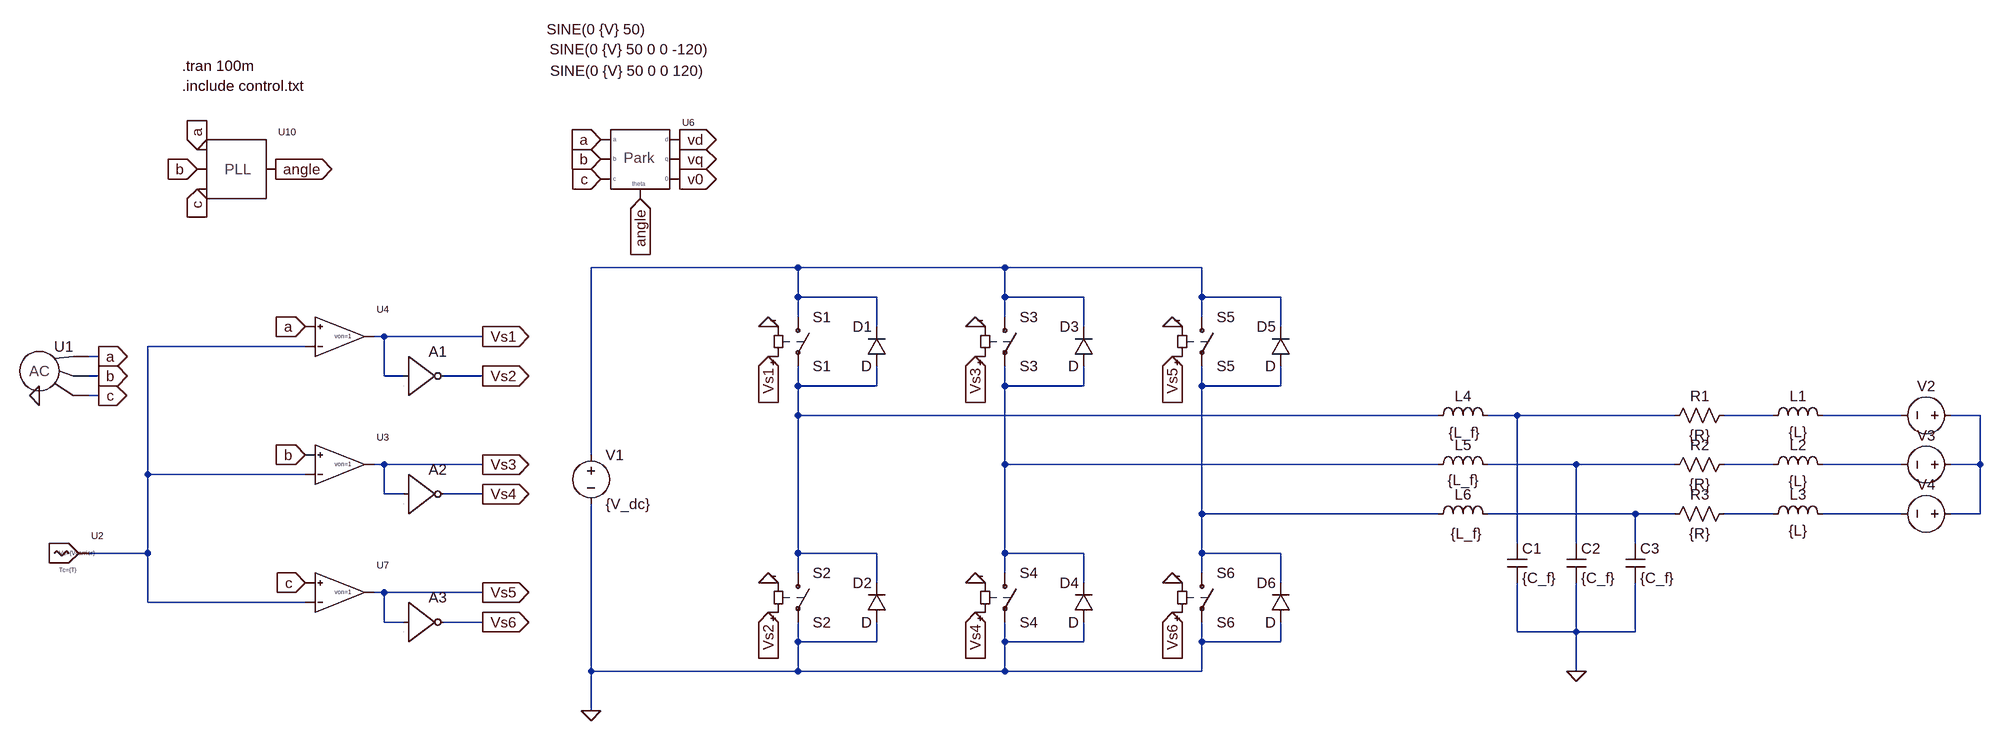
[diagram p0: schematic control.asc]
control.asc, the LTspice schematic file:
Version 4
SHEET 1 1320 772
WIRE -608 32 -944 32
WIRE -272 32 -608 32
WIRE 48 32 -272 32
WIRE -608 80 -608 32
WIRE -480 80 -608 80
WIRE -272 80 -272 32
WIRE -144 80 -272 80
WIRE 48 80 48 32
WIRE 176 80 48 80
WIRE -608 112 -608 80
WIRE -272 112 -272 80
WIRE 48 112 48 80
WIRE -480 128 -480 80
WIRE -144 128 -144 80
WIRE 176 128 176 80
WIRE -1280 144 -1296 144
WIRE -1120 144 -1280 144
WIRE -1408 160 -1664 160
WIRE -1744 176 -1760 176
WIRE -1744 208 -1760 208
WIRE -1280 208 -1280 144
WIRE -1248 208 -1280 208
WIRE -1120 208 -1184 208
WIRE -608 224 -608 192
WIRE -480 224 -480 192
WIRE -480 224 -608 224
WIRE -272 224 -272 192
WIRE -144 224 -144 192
WIRE -144 224 -272 224
WIRE 48 224 48 192
WIRE 176 224 176 192
WIRE 176 224 48 224
WIRE -1744 240 -1760 240
WIRE -608 272 -608 224
WIRE 432 272 -608 272
WIRE 560 272 512 272
WIRE 816 272 560 272
WIRE 976 272 896 272
WIRE 1184 272 1056 272
WIRE 1312 272 1264 272
WIRE -944 336 -944 32
WIRE -1280 352 -1296 352
WIRE -1120 352 -1280 352
WIRE -272 352 -272 224
WIRE 432 352 -272 352
WIRE 656 352 512 352
WIRE 816 352 656 352
WIRE 976 352 896 352
WIRE 1184 352 1056 352
WIRE 1312 352 1312 272
WIRE 1312 352 1264 352
WIRE -1664 368 -1664 160
WIRE -1408 368 -1664 368
WIRE -1280 400 -1280 352
WIRE -1248 400 -1280 400
WIRE -1120 400 -1184 400
WIRE 48 432 48 224
WIRE 432 432 48 432
WIRE 752 432 512 432
WIRE 816 432 752 432
WIRE 976 432 896 432
WIRE 1184 432 1056 432
WIRE 1312 432 1312 352
WIRE 1312 432 1264 432
WIRE 560 480 560 272
WIRE 656 480 656 352
WIRE 752 480 752 432
WIRE -1664 496 -1664 368
WIRE -1664 496 -1760 496
WIRE -608 496 -608 272
WIRE -480 496 -608 496
WIRE -272 496 -272 352
WIRE -144 496 -272 496
WIRE 48 496 48 432
WIRE 176 496 48 496
WIRE -608 528 -608 496
WIRE -272 528 -272 496
WIRE 48 528 48 496
WIRE -480 544 -480 496
WIRE -144 544 -144 496
WIRE 176 544 176 496
WIRE -1280 560 -1296 560
WIRE -1120 560 -1280 560
WIRE -1664 576 -1664 496
WIRE -1408 576 -1664 576
WIRE -1280 608 -1280 560
WIRE -1248 608 -1280 608
WIRE -1120 608 -1184 608
WIRE 560 624 560 544
WIRE 656 624 656 544
WIRE 656 624 560 624
WIRE 752 624 752 544
WIRE 752 624 656 624
WIRE -608 640 -608 608
WIRE -480 640 -480 608
WIRE -480 640 -608 640
WIRE -272 640 -272 608
WIRE -144 640 -144 608
WIRE -144 640 -272 640
WIRE 48 640 48 608
WIRE 176 640 176 608
WIRE 176 640 48 640
WIRE -944 688 -944 416
WIRE -608 688 -608 640
WIRE -608 688 -944 688
WIRE -272 688 -272 640
WIRE -272 688 -608 688
WIRE 48 688 48 640
WIRE 48 688 -272 688
WIRE 656 688 656 624
WIRE -944 752 -944 688
FLAG -656 128 0
FLAG -656 544 0
FLAG -320 128 0
FLAG 0 128 0
FLAG 0 544 0
FLAG -320 544 0
FLAG -1744 176 a
IOPIN -1744 176 Out
FLAG -1744 208 b
IOPIN -1744 208 Out
FLAG -1744 240 c
IOPIN -1744 240 Out
FLAG -1408 128 a
IOPIN -1408 128 In
FLAG -1408 336 b
IOPIN -1408 336 In
FLAG -1408 544 c
IOPIN -1408 544 In
FLAG -1120 144 Vs1
IOPIN -1120 144 Out
FLAG -1120 352 Vs3
IOPIN -1120 352 Out
FLAG -1120 560 Vs5
IOPIN -1120 560 Out
FLAG -1120 208 Vs2
IOPIN -1120 208 Out
FLAG -1120 400 Vs4
IOPIN -1120 400 Out
FLAG -1120 608 Vs6
IOPIN -1120 608 Out
FLAG -656 176 Vs1
IOPIN -656 176 In
FLAG -320 176 Vs3
IOPIN -320 176 In
FLAG -320 592 Vs4
IOPIN -320 592 In
FLAG 0 176 Vs5
IOPIN 0 176 In
FLAG 0 592 Vs6
IOPIN 0 592 In
FLAG -656 592 Vs2
IOPIN -656 592 In
FLAG -944 752 0
FLAG -1456 -128 angle
IOPIN -1456 -128 Out
FLAG -928 -176 a
IOPIN -928 -176 In
FLAG -928 -144 b
IOPIN -928 -144 In
FLAG -928 -112 c
IOPIN -928 -112 In
FLAG -1584 -160 a
IOPIN -1584 -160 In
FLAG -1584 -128 b
IOPIN -1584 -128 In
FLAG -1584 -96 c
IOPIN -1584 -96 In
FLAG -864 -80 angle
IOPIN -864 -80 In
FLAG -800 -176 vd
IOPIN -800 -176 Out
FLAG -800 -144 vq
IOPIN -800 -144 Out
FLAG -800 -112 v0
IOPIN -800 -112 Out
FLAG 656 688 0
FLAG -1840 240 0
SYMBOL voltage -944 320 R0
WINDOW 123 0 0 Left 0
WINDOW 39 0 0 Left 0
SYMATTR InstName V1
SYMATTR Value {V_dc}
SYMBOL sw -608 96 R0
SYMATTR InstName S1
SYMATTR Value S1
SYMBOL sw -608 512 R0
SYMATTR InstName S2
SYMATTR Value S2
SYMBOL sw -272 96 R0
SYMATTR InstName S3
SYMATTR Value S3
SYMBOL sw -272 512 R0
SYMATTR InstName S4
SYMATTR Value S4
SYMBOL sw 48 96 R0
SYMATTR InstName S5
SYMATTR Value S5
SYMBOL sw 48 512 R0
SYMATTR InstName S6
SYMATTR Value S6
SYMBOL diode -464 192 R180
WINDOW 0 24 64 Left 2
WINDOW 3 24 0 Left 2
SYMATTR InstName D1
SYMBOL diode -464 608 R180
WINDOW 0 24 64 Left 2
WINDOW 3 24 0 Left 2
SYMATTR InstName D2
SYMBOL diode -128 192 R180
WINDOW 0 24 64 Left 2
WINDOW 3 24 0 Left 2
SYMATTR InstName D3
SYMBOL diode -128 608 R180
WINDOW 0 24 64 Left 2
WINDOW 3 24 0 Left 2
SYMATTR InstName D4
SYMBOL diode 192 192 R180
WINDOW 0 24 64 Left 2
WINDOW 3 24 0 Left 2
SYMATTR InstName D5
SYMBOL diode 192 608 R180
WINDOW 0 24 64 Left 2
WINDOW 3 24 0 Left 2
SYMATTR InstName D6
SYMBOL res 912 256 R90
WINDOW 0 0 56 VBottom 2
WINDOW 3 32 56 VTop 2
SYMATTR InstName R1
SYMATTR Value {R}
SYMBOL res 912 336 R90
WINDOW 0 0 56 VBottom 2
WINDOW 3 32 56 VTop 2
SYMATTR InstName R2
SYMATTR Value {R}
SYMBOL res 912 416 R90
WINDOW 0 0 56 VBottom 2
WINDOW 3 32 56 VTop 2
SYMATTR InstName R3
SYMATTR Value {R}
SYMBOL voltage 1280 272 R90
WINDOW 0 -32 56 VBottom 2
WINDOW 3 -643 2217 VTop 2
WINDOW 123 0 0 Left 0
WINDOW 39 0 0 Left 0
SYMATTR InstName V2
SYMATTR Value SINE(0 {V} 50)
SYMBOL voltage 1280 352 R90
WINDOW 0 -32 56 VBottom 2
WINDOW 3 -691 2164 VTop 2
WINDOW 123 0 0 Left 0
WINDOW 39 0 0 Left 0
SYMATTR InstName V3
SYMATTR Value SINE(0 {V} 50 0 0 -120)
SYMBOL voltage 1280 432 R90
WINDOW 0 -32 56 VBottom 2
WINDOW 3 -736 2167 VTop 2
WINDOW 123 0 0 Left 0
WINDOW 39 0 0 Left 0
SYMATTR InstName V4
SYMATTR Value SINE(0 {V} 50 0 0 120)
SYMBOL ind 960 288 R270
WINDOW 0 32 56 VTop 2
WINDOW 3 5 56 VBottom 2
SYMATTR InstName L1
SYMATTR Value {L}
SYMBOL ind 960 368 R270
WINDOW 0 32 56 VTop 2
WINDOW 3 5 56 VBottom 2
SYMATTR InstName L2
SYMATTR Value {L}
SYMBOL ind 960 448 R270
WINDOW 0 32 56 VTop 2
WINDOW 3 5 56 VBottom 2
SYMATTR InstName L3
SYMATTR Value {L}
SYMBOL ind 416 288 R270
WINDOW 0 32 56 VTop 2
WINDOW 3 4 58 VBottom 2
SYMATTR InstName L4
SYMATTR Value {L_f}
SYMBOL ind 416 368 R270
WINDOW 0 32 56 VTop 2
WINDOW 3 7 56 VBottom 2
SYMATTR InstName L5
SYMATTR Value {L_f}
SYMBOL ind 416 448 R270
WINDOW 0 32 56 VTop 2
WINDOW 3 0 61 VBottom 2
SYMATTR InstName L6
SYMATTR Value {L_f}
SYMBOL cap 544 480 R0
SYMATTR InstName C1
SYMATTR Value {C_f}
SYMBOL cap 640 480 R0
SYMATTR InstName C2
SYMATTR Value {C_f}
SYMBOL cap 736 480 R0
SYMATTR InstName C3
SYMATTR Value {C_f}
SYMBOL Yn3Phase -1840 144 R0
SYMATTR InstName U1
SYMBOL park -864 -144 R0
SYMATTR InstName U6
SYMBOL trianglesignal -1808 496 R0
WINDOW 3 0 0 Left 0
WINDOW 123 0 28 Left 0
SYMATTR Value Vc={Vcarrier}
SYMATTR Value2 Tc={T}
SYMATTR InstName U2
SYMBOL comparator -1360 560 R0
WINDOW 3 0 0 Left 0
SYMATTR InstName U7
SYMATTR Value von=1
SYMBOL comparator -1360 352 R0
WINDOW 3 0 0 Left 0
SYMATTR InstName U3
SYMATTR Value von=1
SYMBOL comparator -1360 144 R0
WINDOW 3 0 0 Left 0
SYMATTR InstName U4
SYMATTR Value von=1
SYMBOL PLL -1520 -128 R0
SYMATTR InstName U10
SYMBOL Digital\\inv -1248 144 R0
SYMATTR InstName A1
SYMBOL Digital\\inv -1248 336 R0
SYMATTR InstName A2
SYMBOL Digital\\inv -1248 544 R0
SYMATTR InstName A3
TEXT -1608 -296 Left 2 !.tran 100m
TEXT -1608 -264 Left 2 !.include control.txt

The netlist it stands for:
* control.asc
V1 N001 0 {V_dc}
S1 N001 N003 Vs1 0 S1
S2 N003 0 Vs2 0 S2
S3 N001 N004 Vs3 0 S3
S4 N004 0 Vs4 0 S4
S5 N001 N005 Vs5 0 S5
S6 N005 0 Vs6 0 S6
D1 N003 N001 D
D2 0 N003 D
D3 N004 N001 D
D4 0 N004 D
D5 N005 N001 D
D6 0 N005 D
R1 N007 N006 {R}
R2 N011 N010 {R}
R3 N014 N013 {R}
V2 N009 N008 SINE(0 {V} 50)
V3 N009 N012 SINE(0 {V} 50 0 0 -120)
V4 N009 N015 SINE(0 {V} 50 0 0 120)
L1 N007 N008 {L}
L2 N011 N012 {L}
L3 N014 N015 {L}
L4 N003 N006 {L_f}
L5 N004 N010 {L_f}
L6 N005 N013 {L_f}
C1 N006 0 {C_f}
C2 N010 0 {C_f}
C3 N013 0 {C_f}
XU1 a b c 0 Yn3Phase  ; pins OUTA OUTB OUTC N
XU6 a b c angle vd vq v0 ParkTrans  ; pins a b c theta d q zero
XU2 N002 triangle Vc={Vcarrier} Tc={T}  ; pins 1
XU7 c N002 Vs5 compare von=1  ; pins 1 2 3
XU3 b N002 Vs3 compare von=1  ; pins 1 2 3
XU4 a N002 Vs1 compare von=1  ; pins 1 2 3
XU10 a b c angle PLL  ; pins a b c theta
A1 Vs1 0 0 0 0 Vs2 0 0 BUF
A2 Vs3 0 0 0 0 Vs4 0 0 BUF
A3 Vs5 0 0 0 0 Vs6 0 0 BUF
.model D D
.lib standard.dio
.tran 100m
.include control.txt
.lib pwr-ctrl.lib
.lib PLL.lib
.backanno
.end